# Altium schematic sheet ArcadeTestHAT 05 MCU.SchDoc: MCU and associated circuitry
size A3; SheetNumber: 2; SheetTotal: 2; VersionControl_RevNumber: 1
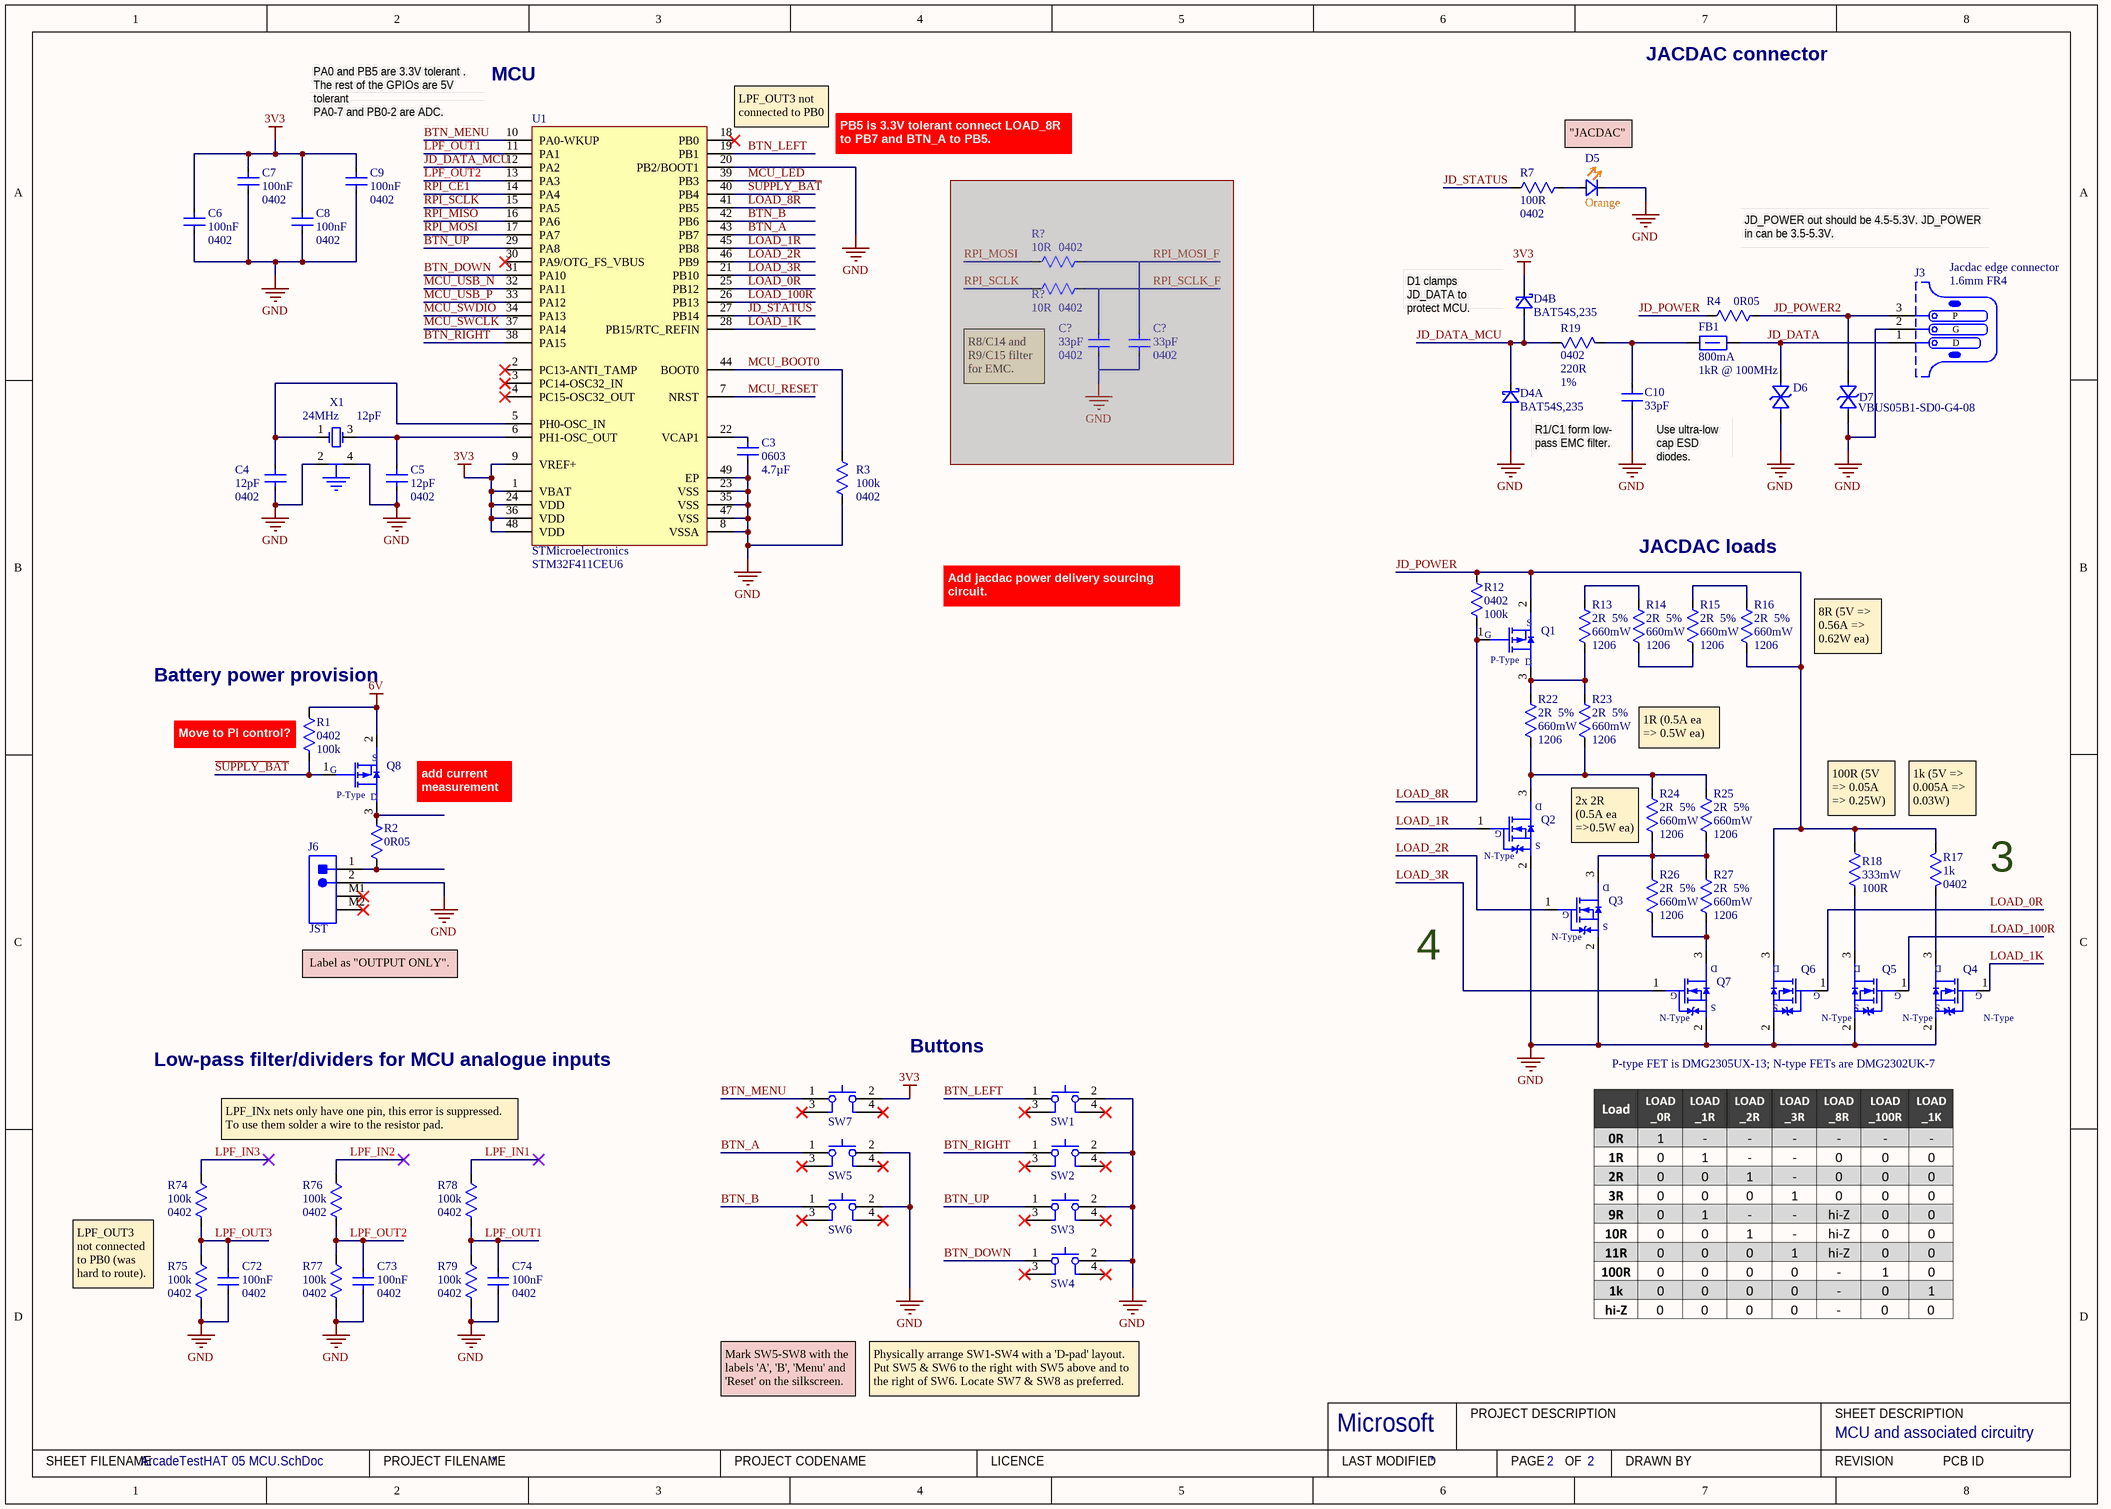
[diagram p0: ArcadeTestHAT 05 MCU.SchDoc]

## Parts
(Parts that share a designator on the sheet are numbered #1, #2 ... from top to bottom, then left to right.)
C3  Case/Package: 0603  Capacitance: 4.7µF  [CAP 0603 (1608) x 1.2mm]  (hidden comment: CL10A475KP8NNNC)
C4  value 12pF  Package Size: 0402  [CAP0402]  (hidden comment: CAP0402_GENERIC 12pF)
C5  value 12pF  Package Size: 0402  [CAP0402]  (hidden comment: CAP0402_GENERIC 12pF)
C6  Case/Package: 0402  Capacitance: 100nF  [CAP0402]  (hidden comment: 0402YG104ZAT2A)
C7  Case/Package: 0402  Capacitance: 100nF  [CAP0402]  (hidden comment: 0402YG104ZAT2A)
C8  Case/Package: 0402  Capacitance: 100nF  [CAP0402]  (hidden comment: 0402YG104ZAT2A)
C9  Case/Package: 0402  Capacitance: 100nF  [CAP0402]  (hidden comment: 0402YG104ZAT2A)
C10  Capacitance: 33pF  [CAPC1005-EIA0402 0.55MM HIGH]  (hidden comment: C1005C0G1H330J050BA)
C72  Case/Package: 0402  Capacitance: 100nF  [CAP0402]  (hidden comment: 0402YG104ZAT2A)
C73  Case/Package: 0402  Capacitance: 100nF  [CAP0402]  (hidden comment: 0402YG104ZAT2A)
C74  Case/Package: 0402  Capacitance: 100nF  [CAP0402]  (hidden comment: 0402YG104ZAT2A)
C?#1  value 33pF  Package Size: 0402  [CAP0402]  (hidden comment: CAP0402_GENERIC 33pF)  (masked out: inside a compile mask, not in the netlist)
C?#2  value 33pF  Package Size: 0402  [CAP0402]  (hidden comment: CAP0402_GENERIC 33pF)  (masked out: inside a compile mask, not in the netlist)
D4  Manufacturer Part Number: BAT54S,235  [NXP-BAT54S-TO-236AB - without outline]  (hidden comment: BAT54S)  (parts A,B of 2)
D5  Colour: Orange  [Rohm SML-D12 Orange]  (hidden comment: SML-D12D)
D6  VBUS05B1-SD0-G4-08  [0201-VBUS05B1-SD0-G4-08 - Without outline]  (value not drawn)
D7  VBUS05B1-SD0-G4-08  [0201-VBUS05B1-SD0-G4-08 - Without outline]
FB1  Current Rating: 800mA  Impedance: 1kR @ 100MHz  [TDK MPZ1608 0.8mm - without outline]  (hidden comment: TDK MPZ1608S102ATA00)
J3  Jacdac edge connector  PCB Type: 1.6mm FR4  [JACDAC_EDGE_CONNECTOR_0.2mm_T&G]  (no BOM)
J6  Manufacturer: JST  [JST- S2B-PH-SM4-TB(LF)(SN)-2_V]  (hidden comment: S2B-PH-SM4-TB(LF)(SN) (originally from Octopart))
Q1  MOSFET P-CH 20V 4.2A SOT23  [DIODES-SOT23-3]  (value not drawn)
Q2  MOSFET N-CH 20V 2.8A SOT23  [DIODES-SOT23-3]  (value not drawn)
Q3  MOSFET N-CH 20V 2.8A SOT23  [DIODES-SOT23-3]  (value not drawn)
Q4  MOSFET N-CH 20V 2.8A SOT23  [DIODES-SOT23-3]  (value not drawn)
Q5  MOSFET N-CH 20V 2.8A SOT23  [DIODES-SOT23-3]  (value not drawn)
Q6  MOSFET N-CH 20V 2.8A SOT23  [DIODES-SOT23-3]  (value not drawn)
Q7  MOSFET N-CH 20V 2.8A SOT23  [DIODES-SOT23-3]  (value not drawn)
Q8  MOSFET P-CH 20V 4.2A SOT23  [DIODES-SOT23-3]  (value not drawn)
R1  Case Code (Imperial): 0402  Resistance: 100k  [RES0402]  (hidden comment: MCWR04X1003FTL)
R2  value 0R05  [RES1206]  (hidden comment: KDV12FR050ET)
R3  Case Code (Imperial): 0402  Resistance: 100k  [RES0402]  (hidden comment: MCWR04X1003FTL)
R4  value 0R05  [RES1206]  (hidden comment: KDV12FR050ET)
R7  value 100R  Case: 0402  [RES0402]  (hidden comment: RES0402_GENERIC 100R)
R12  Case Code (Imperial): 0402  Resistance: 100k  [RES0402]  (hidden comment: MCWR04X1003FTL)
R13  Tolerance: 5%  Case/Package: 1206  Power Rating: 660mW  Resistance: 2R  [RES1206]  (hidden comment: ERJ-P08J2R0V)
R14  Tolerance: 5%  Case/Package: 1206  Power Rating: 660mW  Resistance: 2R  [RES1206]  (hidden comment: ERJ-P08J2R0V)
R15  Tolerance: 5%  Case/Package: 1206  Power Rating: 660mW  Resistance: 2R  [RES1206]  (hidden comment: ERJ-P08J2R0V)
R16  Tolerance: 5%  Case/Package: 1206  Power Rating: 660mW  Resistance: 2R  [RES1206]  (hidden comment: ERJ-P08J2R0V)
R17  Case: 0402  [RES0402]  (hidden comment: 1k)
R18  Max Power Dissipation: 333mW  Resistance: 100R  [RES0805]
R19  Case Code (Imperial): 0402  Resistance: 220R  Tolerance: 1%  [RES0402]  (hidden comment: RC0402FR-07220RL)
R22  Tolerance: 5%  Case/Package: 1206  Power Rating: 660mW  Resistance: 2R  [RES1206]  (hidden comment: ERJ-P08J2R0V)
R23  Tolerance: 5%  Case/Package: 1206  Power Rating: 660mW  Resistance: 2R  [RES1206]  (hidden comment: ERJ-P08J2R0V)
R24  Tolerance: 5%  Case/Package: 1206  Power Rating: 660mW  Resistance: 2R  [RES1206]  (hidden comment: ERJ-P08J2R0V)
R25  Tolerance: 5%  Case/Package: 1206  Power Rating: 660mW  Resistance: 2R  [RES1206]  (hidden comment: ERJ-P08J2R0V)
R26  Tolerance: 5%  Case/Package: 1206  Power Rating: 660mW  Resistance: 2R  [RES1206]  (hidden comment: ERJ-P08J2R0V)
R27  Tolerance: 5%  Case/Package: 1206  Power Rating: 660mW  Resistance: 2R  [RES1206]  (hidden comment: ERJ-P08J2R0V)
R74  Case Code (Imperial): 0402  Resistance: 100k  [RES0402]  (hidden comment: MCWR04X1003FTL)
R75  Case Code (Imperial): 0402  Resistance: 100k  [RES0402]  (hidden comment: MCWR04X1003FTL)
R76  Case Code (Imperial): 0402  Resistance: 100k  [RES0402]  (hidden comment: MCWR04X1003FTL)
R77  Case Code (Imperial): 0402  Resistance: 100k  [RES0402]  (hidden comment: MCWR04X1003FTL)
R78  Case Code (Imperial): 0402  Resistance: 100k  [RES0402]  (hidden comment: MCWR04X1003FTL)
R79  Case Code (Imperial): 0402  Resistance: 100k  [RES0402]  (hidden comment: MCWR04X1003FTL)
R?#1  value 10R  Case: 0402  [RES0402]  (hidden comment: RES0402_GENERIC 10R)  (masked out: inside a compile mask, not in the netlist)
R?#2  value 10R  Case: 0402  [RES0402]  (hidden comment: RES0402_GENERIC 10R)  (masked out: inside a compile mask, not in the netlist)
SW1  Tact Wurth 430152050826  [Wurth 430152050836-WIDE]  (value not drawn)
SW2  Tact Wurth 430152050826  [Wurth 430152050836-WIDE]  (value not drawn)
SW3  Tact Wurth 430152050826  [Wurth 430152050836-WIDE]  (value not drawn)
SW4  Tact Wurth 430152050826  [Wurth 430152050836-WIDE]  (value not drawn)
SW5  Tact Wurth 430152050826  [Wurth 430152050836-WIDE]  (value not drawn)
SW6  Tact Wurth 430152050826  [Wurth 430152050836-WIDE]  (value not drawn)
SW7  Tact Wurth 430152050826  [Wurth 430152050836-WIDE]  (value not drawn)
U1  Manufacturer: STMicroelectronics  Manufacturer Part Number: STM32F411CEU6  [ST UFQFPN48 SEH]  (hidden comment: ST STM32F411CEU6)
X1  Frequency: 24MHz  Loading capacitance: 12pF  [generic xtal 3.2x2.5]  (hidden comment: 24MHz SMD xtal 3.2x2.5mm)

## Nets
3V3: C6.2 C7.2 C8.2 C9.2 D4.2(K) SW7.2 U1.1(VBAT) U1.9(VREF+) U1.24(VDD) U1.36(VDD) U1.48(VDD)
6V: Q8.2(S) R1.1
GND: C3.1 C4.1 C5.1 C6.1 C7.1 C8.1 C9.1 C10.1 C72.1 C73.1 C74.1 D4.1(A) D5.1(K) D6.2(A) D7.2(A) J3.2(G) J6.2 Q2.2(S) Q3.2(S) Q4.2(S) Q5.2(S) Q6.2(S) Q7.2(S) R3.2 R75.2 R77.2 R79.2 SW1.2 SW2.2 SW3.2 SW4.2 SW5.2 SW6.2 U1.8(VSSA) U1.20(PB2/BOOT1) U1.23(VSS) U1.35(VSS) U1.47(VSS) U1.49(EP) X1.2 X1.4
~{SUPPLY_BAT}: Q8.1(G) R1.2 U1.40(PB4)
BTN_A: SW5.1 U1.43(PB7)
BTN_B: SW6.1 U1.42(PB6)
BTN_DOWN: SW4.1 U1.31(PA10)
BTN_LEFT: SW1.1 U1.19(PB1)
BTN_MENU: SW7.1 U1.10(PA0-WKUP)
BTN_RIGHT: SW2.1 U1.38(PA15)
BTN_UP: SW3.1 U1.29(PA8)
JD_DATA: D6.1(K) FB1.1 J3.1(D)
JD_DATA_MCU: D4.3(K) R19.1 U1.12(PA2)
JD_POWER: Q1.2(S) Q6.3(D) R4.1 R12.1 R16.2 R17.1 R18.1
JD_POWER2: D7.1(K) J3.3(P) R4.2
JD_STATUS: R7.1 U1.27(PB14)
LOAD_0R: Q6.1(G) U1.25(PB12)
LOAD_1K: Q4.1(G) U1.28(PB15/RTC_REFIN)
LOAD_1R: Q2.1(G) U1.45(PB8)
LOAD_2R: Q3.1(G) U1.46(PB9)
LOAD_3R: Q7.1(G) U1.21(PB10)
LOAD_8R: Q1.1(G) R12.2 U1.41(PB5)
LOAD_100R: Q5.1(G) U1.26(PB13)
LPF_IN1: R78.1
LPF_IN2: R76.1
LPF_IN3: R74.1
LPF_OUT1: C74.2 R78.2 R79.1 U1.11(PA1)
LPF_OUT2: C73.2 R76.2 R77.1 U1.13(PA3)
LPF_OUT3: C72.2 R74.2 R75.1
MCU_BOOT0: R3.1 U1.44(BOOT0)
MCU_LED: U1.39(PB3)
MCU_RESET: U1.7(NRST)
MCU_SWCLK: U1.37(PA14)
MCU_SWDIO: U1.34(PA13)
MCU_USB_N: U1.32(PA11)
MCU_USB_P: U1.33(PA12)
RPI_CE1: U1.14(PA4)
RPI_MISO: U1.16(PA6)
RPI_MOSI: U1.17(PA7)
RPI_SCLK: U1.15(PA5)
NetC3_2: C3.2 U1.22(VCAP1)
NetC4_2: C4.2 U1.5(PH0-OSC_IN) X1.1
NetC5_2: C5.2 U1.6(PH1-OSC_OUT) X1.3
NetC10_2: C10.2 FB1.2 R19.2
NetD5_2: D5.2(A) R7.2
NetJ6_1: J6.1 R2.1
NetQ1_3: Q1.3(D) R13.2 R22.1 R23.1
NetQ2_3: Q2.3(D) R22.2 R23.2 R24.1 R25.1
NetQ3_3: Q3.3(D) R24.2 R25.2 R26.1 R27.1
NetQ4_3: Q4.3(D) R17.2
NetQ5_3: Q5.3(D) R18.2
NetQ7_3: Q7.3(D) R26.2 R27.2
NetQ8_3: Q8.3(D) R2.2
NetR13_1: R13.1 R14.1
NetR14_2: R14.2 R15.2
NetR15_1: R15.1 R16.1

Not connected (* = marked no-connect by the designer): J6 M1* M2*; SW1 3* 4*; SW2 3* 4*; SW3 3* 4*; SW4 3* 4*; SW5 3* 4*; SW6 3* 4*; SW7 3* 4*; U1 2(PC13-ANTI_TAMP)* 3(PC14-OSC32_IN)* 4(PC15-OSC32_OUT)* 18(PB0)* 30(PA9/OTG_FS_VBUS)*

## Notes on the sheet
- PA0 and PB5 are 3.3V tolerant . The rest of the GPIOs are 5V tolerant
- MCU
- JACDAC connector
- PA0-7 and PB0-2 are ADC.
- (near U1) LPF_OUT3 not connected to PB0
- PB5 is 3.3V tolerant connect LOAD_8R to PB7 and BTN_A to PB5.
- "JACDAC"
- JD_POWER out should be 4.5-5.3V. JD_POWER in can be 3.5-5.3V.
- (near D4) D1 clamps JD_DATA to protect MCU.
- R8/C14 and R9/C15 filter for EMC.
- R1/C1 form low-
  pass EMC filter.
- (near C10) Use ultra-low cap ESD diodes.
- JACDAC loads
- Add jacdac power delivery sourcing circuit.
- 8R (5V => 0.56A => 0.62W ea)
- (near R1) Battery power provision
- (near R1) Move to Pi control?
- 1R (0.5A ea => 0.5W ea)
- add current measurement
- (near R24) 2x 2R (0.5A ea =>0.5W ea)
- 100R (5V => 0.05A => 0.25W)
- (near R17) 1k (5V => 0.005A => 0.03W)
- (near R17) 3
- (near J6) Label as "OUTPUT ONLY".
- 4
- Buttons
- Low-pass filter/dividers for MCU analogue inputs
- P-type FET is DMG2305UX-13; N-type FETs are DMG2302UK-7
- LPF_INx nets only have one pin, this error is suppressed. To use them solder a wire to the resistor pad.
- LPF_OUT3 not connected to PB0 (was hard to route).
- Mark SW5-SW8 with the labels 'A', 'B', 'Menu' and 'Reset' on the silkscreen.
- Physically arrange SW1-SW4 with a 'D-pad' layout. Put SW5 & SW6 to the right with SW5 above and to the right of SW6. Locate SW7 & SW8 as preferred.
- Microsoft
- PROJECT DESCRIPTION
- SHEET DESCRIPTION
- SHEET FILENAME
- PROJECT FILENAME
- PROJECT CODENAME
- LICENCE
- LAST MODIFIED
- PAGE
- OF
- DRAWN BY
- REVISION
- PCB ID
- (in symbol DMG2302UK-whitesch) N-Type
- (in symbol DMG2305UX-whitesch) P-Type

## Library data of the parts
C3 = 4.7uF 10V X5R ±10% Samsung CL: Generic 0603 capacitor 4.7uF 10V, e.g. Samsung CL10A475KP8NNNC; Dielectric: X5R; Tolerance: 10%; Created By: shodges; Supplier 1: Digi-Key; Manufacturer: Samsung; Manufacturer Part Number: CL10A475KP8NNNC; Stock 1: 40000; Pricing 1: 1=0.15, 10=0.109, 100=0.0513, 500=0.036, 1000=0.0298 (USD); Mount: Surface Mount; Case Code (Imperial): 0603; Contact Plating: Tin; Min Operating Temperature: -55°C; Max Operating Temperature: 85°C; Package Quantity: 1; Packaging: Tape and Reel; Length: 1.6mm; Height: 0.8mm; Width: 0.031inch; Thickness: 0.035inch; Depth: 0.8mm; Radiation Hardening: No; Supplier Part Number 1: 1276-1044-1-ND; Supplier 2: Farnell; Supplier Part Number 2: 3010071; Case Code (Metric): 1608; Voltage Rating: 10V
C4 C5 = CAP0402_GENERIC: Generic 0402 capacitor 12pF; Rated Voltage: * V; Manufacturer: Generic
C6-C9 C72-C74 = 0402YG104ZAT2A: Generic 0402 capacitor 100nF 16V, e.g. AVX 0402YG104ZAT2A; Manufacturer: Kyocera AVX; Tolerance: 80%; Dielectric: Y5V; Insulation Resistance: 100GR; Dissipation Factor: 9%; Supplier 1: Digi-Key; Manufacturer Part Number: 0402YG104ZAT2A; Stock 1: 0; Pricing 1: 1=0.1, 10=0.041, 100=0.0183, 500=0.01306, 1000=0.01026, 2500=0.00933, 5000=0.00858 (USD); Mount: Surface Mount,PCB; Case Code (Metric): 1005; Case Code (Imperial): 0402; Contact Plating: Tin,Matte; Min Operating Temperature: -30°C; Max Operating Temperature: 85°C; Packaging: Tape and Reel; Voltage Rating (DC): 16V; Termination: SMD/SMT; Voltage: 16V; Package Quantity: 1; Voltage Rating: 16V; Length: 1mm; Height: 0.5mm; Depth: 0.5mm; Width: 0.02inch; Thickness: 0.022inch; Radiation Hardening: No; REACH SVHC: No SVHC; Lead Free: Lead Free; ComponentLink2URL: http://datasheets.avx.com/Y5V.pdf; ComponentLink2Description: AVX datasheet online; Supplier 2: Farnell; Supplier 3: Mouser; Supplier 4: RSComponents; Supplier Part Number 1: 478-1138-1-ND; Supplier Part Number 2: 1327667; Supplier Part Number 3: 581-040216G104Z; Supplier Part Number 4: 698-3190
C10 = 33pF 0402 C0G, NP0 50V: CAP CER 33PF 50V C0G 0402; Manufacturer: TDK Corporation; Tolerance: ±5%; Dielectric Material: Ceramic; Supplier 1: Mouser; Manufacturer Part Number: C1005C0G1H330J050BA; RoHS: RoHS Compliant; Category: Capacitors; Stock 1: 78754; Pricing 1: 1=0.25000, 10=0.03100, 100=0.02200, 500=0.01900, 1000=0.01500, 2500=0.01200, 10000=0.00900, 20000=0.00800, 50000=0.00700 (USD); Packaging: Tape & Reel (TR); Voltage - Rated: 50V; Temperature Coefficient: C0G, NP0; Mounting Type: Surface Mount, MLCC; Operating Temperature: -55°C ~ 125°C; Applications: General Purpose; Package / Case: 0402 (1005 Metric); Size / Dimension: 0.039" L x 0.020" W (1.00mm x 0.50mm); Height - Seated (Max): -; Thickness (Max): 0.022" (0.55mm); Lead Spacing: -; Features: -; Lead Style: -; ComponentLink1URL: http://product.tdk.com/en/catalog/datasheets/mlcc_commercial_general_en.pdf; ComponentLink1Description: Online datasheet; Supplier Part Number 1: 810-C1005C0G1H330J; Ratings: -; Mount: Surface Mount; Case/Package: 0402; Case Code (Imperial): 0402; Case Code (Metric): 1005; Weight: 2.3E-05oz; Min Operating Temperature: -55°C; Max Operating Temperature: 125°C; Dielectric: C0G; Termination: SMD/SMT; Voltage: 50V; Voltage Rating: 50V; Voltage Rating (DC): 50V; Package Quantity: 1; Length: 1mm; Width: 0.5mm; Height: 0.5mm; Depth: 0.5mm; Thickness: 0.022inch; Radiation Hardening: No; Lead Free: Lead Free; REACH SVHC: No SVHC; Supplier 2: Farnell; Stock 2: 30000; Pricing 2: 10000=0.00620 (GBP); Supplier 3: Future Electronics; Stock 3: 10000; Pricing 3: 10000=0.00850, 30000=0.00700, 40000=0.00700, 100000=0.00690, 150000=0.00680 (USD); Supplier Part Number 2: 2521806; Supplier Part Number 3: 4011038
C?#1 C?#2 = CAP0402_GENERIC: Generic 0402 Chip Capacitor 33pF; Rated Voltage: * V
D4 = BAT54S: DIODE ARRAY SCHOTTKY 30V SOT23; Manufacturer: Nexperia; Supplier 1: Digi-Key; RoHS: No; Category: Rectifier Diodes; Stock 1: 14011; Pricing 1: 1=0.13000, 10=0.11900, 100=0.05610, 500=0.03326, 1000=0.02185, 5000=0.02138 (USD); ComponentLink1URL: https://assets.nexperia.com/documents/data-sheet/BAT54_SER.pdf; ComponentLink1Description: NXP datasheet online; Supplier 2: Mouser; Supplier 3: RSComponents; Supplier Part Number 2: 771-BAT54S235; Supplier Part Number 3: 1707990; Supplier Part Number 1: 1727-1868-1-ND
D5 = SML-D12D: 1.6 x 0.8 x 0.55mm (0603) LED 605nm Orange; Manufacturer: Rohm Semiconductor; Manufacturer Part Number: SML-D12D8WT86; Millicandela Rating: 100mcd; Voltage - Forward (Vf) (Typ): 2.2V; Current - Test: 20mA; Lens Type: Diffused, White; Lens Style/Size: Rectangle with Flat Top, 1.2mm x 0.8mm; Supplier 1: Digi-Key; RoHS: RoHS Compliant; Category: Optoelectronics; Stock 1: 1719; Pricing 1: 1=0.38, 10=0.279, 25=0.2232, 100=0.1478, 250=0.1046, 500=0.08926, 1000=0.06974 (GBP); Packaging: Cut Tape (CT); Wavelength - Dominant: 605nm; Wavelength - Peak: -; Viewing Angle: -; Package / Case: 0603 (1608 Metric); Size / Dimension: 1.60mm L x 0.80mm W; Height: 0.55mm; Mounting Type: Surface Mount; Luminous Flux @ Current - Test: -; ComponentLink1URL: http://rohmfs.rohm.com/en/products/databook/datasheet/opto/led/chip_mono/sml-d1.pdf; ComponentLink1Description: http://rohmfs.rohm.com/en/products/databook/datasheet/opto/led/chip_mono/sml-d1.pdf; Supplier Part Number 1: 511-1577-1-ND
D6 D7 = VBUS05B1-SD0-G4-08: TVS DIODE 5.5V 18V CLP0603; Manufacturer: Vishay Semiconductors; Peak Pulse Current: 2.5A; Number of Bidirectional Channels: 1; Min Breakdown Voltage: 6V; Peak Pulse Power: 45W; Power Line Protection: No; Direction: Bidirectional; Capacitance: 0.4pF; Element Configuration: Single; Supplier 1: Digi-Key; RoHS: Yes; Category: TVS Diodes; Stock 1: 22028; Pricing 1: 1=0.27000, 10=0.18500, 100=0.09020, 500=0.07524, 1000=0.05228, 2000=0.04531, 5000=0.04203 (USD); Mount: Surface Mount; Case/Package: 0201; Number of Pins: 2; Case Code (Metric): 0603; Case Code (Imperial): 0201; Min Operating Temperature: -55°C; Max Operating Temperature: 150°C; Packaging: Tape and Reel; Reverse Standoff Voltage: 5.5V; Clamping Voltage: 18V; Working Voltage: 5.5V; Resistor Type: Zener; ComponentLink2URL: http://www.vishay.com/docs/85899/vbus05b1-sd0.pdf; ComponentLink2Description: Online datasheet; Supplier 2: Farnell; Stock 2: 13100; Pricing 2: 5=0.20800, 10=0.14000, 100=0.06340, 500=0.05020, 1000=0.04160, 5000=0.03300 (GBP); Supplier 3: Mouser; Stock 3: 1209; Pricing 3: 1=0.27000, 10=0.18500, 50=0.18500, 100=0.09300, 1000=0.03900, 10000=0.03400 (USD); Supplier 4: Arrow Electronics; Stock 4: 719; Pricing 4: 1=0.17630, 10=0.14370, 25=0.14230, 100=0.07810, 250=0.07660, 500=0.06310, 15000=0.02980, 150000=0.02970, 1500000=0.02870, 7500000=0.02800 (USD); Supplier Part Number 4: VBUS05B1-SD0-G4-08; Supplier Part Number 3: 78-VBUS05B1SD0-G4-08; Supplier Part Number 1: VBUS05B1-SD0-G4-08GICT-ND; Supplier Part Number 2: 2932858; Created By: D. Gakure; Checked By: ?; Manufacturer Part Number: VBUS05B1-SD0-G4-08
FB1 = TDK MPZ1608S102ATA00: 0603 1k@100MHz 0.8A chip; Core Material: Ferrite; Tolerance: 25%; DC Resistance (DCR): 300mR; Supplier 1: Digi-Key; Stock 1: 113542; Pricing 1: 1=0.1, 10=0.079, 25=0.0716, 50=0.0644, 100=0.0472, 250=0.03432, 500=0.03146, 1000=0.02717 (USD); Mount: Surface Mount; Case/Package: 0603; Case Code (Metric): 1608; Case Code (Imperial): 0603; Package Quantity: 4000; Packaging: Tape and Reel; Max DC Current: 800mA; Length: 0.063inch; Height: 0.037inch; Width: 0.031inch; ComponentLink2URL: https://www.mouser.co.uk/datasheet/2/400/eads_commercial_power_mpz1608_en-923650.pdf; ComponentLink2Description: datasheet online; Supplier 2: Mouser; ComponentLink3Description: datasheet; ComponentLink3URL: Y:\System\Altium\Libraries 2014\TDK\Datasheets\eads_commercial_power_mpz1608_en-923650.pdf; Supplier Part Number 1: 445-8694-1-ND; Supplier Part Number 2: 810-MPZ1608S102ATA00; Manufacturer: TDK; Manufacturer Part Number: MPZ1608S102ATA00
J3 = Jacdac edge connector: 3 pin Jacdac edge connector 1.27mm pitch; Manufacturer Part Number: JACDAC_EDGE_CONNECTOR; Checked By: ?; Created By: D. Gakure; ComponentLink1Description: Yuliang JACDAC cable connector drawing online; ComponentLink1URL: https://github.com/microsoft/jacdac-mdk/blob/main/connector/JACDAC-Connector-by-Yuliang-2020-11-28.pdf; ComponentLink2Description: JACDAC PCB edge connector spec onlin; ComponentLink2URL: https://github.com/microsoft/jacdac-mdk/blob/main/connector/JACDAC_PCB_Edge_Connector_Drawing_JD-PEC-01_rev_01.pdf
J6 = S2B-PH-SM4-TB(LF)(SN): Male header, pitch 2 mm, 1x2 position; Current Rating: 2A; Voltage Rating: 100V; Number of Poles: 2; Insulation Resistance: 1GR; Contact Resistance: 20mR; Connector Type: Male Pin; Pitch: 2mm; Min Operating Temperature: -25°C; Width: 5mm; ComponentLink1Description: JST connector selector website; ComponentLink2Description: JST datasheet; ComponentLink1URL: http://www.jst.com/home2.html; Contact Plating: Tin,Copper; ComponentLink2URL: http://www.jst-mfg.com/product/pdf/eng/ePH.pdf; Mount: Surface Mount; Length: 7.9mm; Lead Pitch: 2mm; Max Operating Temperature: 85°C; Height: 9.4mm; Packaging: Tape and Reel; Contact Material: Copper Alloy,Bronze,Tin,Brass; Supplier 1: Digi-Key; Stock 1: 179134; Pricing 1: 1=0.58, 10=0.547, 100=0.4194, 500=0.3647 (USD); Color: Natural,White; Housing Color: Beige; Housing Material: Polyamide; Number of Rows: 1; Number of Positions: 2; Termination: Solder; Orientation: Right Angle; Gender: Male; Voltage Rating (AC): 100V; Max Current Rating: 2A; Fastening Type: Detent; Number of Contacts: 2; Working Voltage: 100V; Max Voltage Rating (AC): 100V; Max Voltage Rating (DC): 100V; Contact Mating Length: 0.13inch; Depth: 7.6mm; REACH SVHC: No SVHC; Lead Free: Lead Free; Flammability Rating: UL94 V-0; Supplier 2: Farnell; Supplier 3: RSComponents; Supplier Part Number 1: 455-1749-1-ND; Supplier Part Number 2: 9492615; Supplier Part Number 3: 688-1353; Manufacturer Part Number: S2B-PH-SM4-TB(LF)(SN)
Q1 Q8 = DMG2305UX-whitesch: Manufacturer: Diodes; Manufacturer Part Number: DMG2305UX-13; Rise Time: 13.7ns; Rds On Max: 52mR; Input Capacitance: 808pF; Max Power Dissipation: 1.4W; Turn-On Delay Time: 10.8ns; Turn-Off Delay Time: 79.3ns; Fall Time: 34.7ns; Threshold Voltage: -900mV; Element Configuration: Single; Gate to Source Voltage (Vgs): 8V; Number of Channels: 1; Drain to Source Breakdown Voltage: -20V; On-State Resistance: 65MR; Supplier 1: Digi-Key; Stock 1: 131638; Pricing 1: 1=0.44, 10=0.398, 100=0.2228, 500=0.1194, 1000=0.0812 (USD); Mount: Surface Mount; Case/Package: TO-236-3; Number of Pins: 3; Weight: 0.000282oz; Min Operating Temperature: -55°C; Max Operating Temperature: 150°C; Package Quantity: 1; Packaging: Tape and Reel; Continuous Drain Current (ID): 4.2A; Drain to Source Voltage (Vdss): 20V; Drain to Source Resistance: 52mR; Length: 3mm; Height: 1.1mm; Width: 1.4mm; Radiation Hardening: No; REACH SVHC: No SVHC; Lead Free: Lead Free; ComponentLink2URL: https://datasheet.ciiva.com/18566/dmg2305ux-18566951.pdf; ComponentLink2Description: online datasheet; Supplier Part Number 1: DMG2305UX-13DICT-ND; ComponentLink3Description: datasheet; ComponentLink3URL: Y:\System\Altium\Libraries 2014\Diodes Inc\Datasheets\dmg2305ux-30023840.pdf; Supplier 2: Farnell; Supplier 3: Mouser; Supplier 4: RSComponents; Supplier Part Number 2: 2543533; Supplier Part Number 3: 621-DMG2305UX-7; Supplier Part Number 4: 8270452
Q2-Q7 = DMG2302UK-whitesch: Manufacturer: Diodes; Manufacturer Part Number: DMG2302UK-7; Rds On Max: 90mR; Input Capacitance: 130pF; Max Power Dissipation: 660mW; ComponentLink2URL: https://www.diodes.com/assets/Datasheets/DMG2302UK.pdf; ComponentLink2Description: online datasheet; ComponentLink3Description: datasheet; ComponentLink3URL: Y:\System\Altium\Libraries 2014\Diodes Inc\Datasheets\DMG2302UK.pdf; Supplier 1: Digi-Key; Stock 1: 37938; Pricing 1: 1=0.34000, 10=0.25000, 100=0.11890, 500=0.09704, 1000=0.07199 (USD); RoHS: Yes; Mount: Surface Mount; Case/Package: TO-236-3; Min Operating Temperature: -55°C; Max Operating Temperature: 150°C; Packaging: Tape and Reel; Drain to Source Voltage (Vdss): 20V; Continuous Drain Current (ID): 2.8A; Supplier 2: Farnell; Supplier 3: Mouser; Supplier 4: RSComponents; Supplier Part Number 1: DMG2302UK-7DICT-ND; Supplier Part Number 2: 3127315; Supplier Part Number 3: 621-DMG2302UK-7; Supplier Part Number 4: 1333362
R1 = MCWR04X1003FTL: Generic 0402 resistor 100k, e.g. Multicomp MCWR04X1003FTL; Power Rating: 62.5mW; Tolerance: 1%; Voltage Rating: 50V; Temperature Coefficient: 100ppm/°C; Supplier 1: Farnell; Manufacturer: Multicomp; Manufacturer Part Number: MCWR04X1003FTL; Stock 1: 414470; Pricing 1: 10=0.0041, 100=0.0025, 500=0.0018, 2500=0.0014, 5000=0.0011 (GBP); Mount: Surface Mount; Case/Package: 0402; Case Code (Metric): 1005; Packaging: Cut Tape; Composition: Thick Film; Voltage Rating (DC): 50V; REACH SVHC: No SVHC; ComponentLink1URL: http://www.farnell.com/datasheets/1849611.pdf?src-supplier=Element14; ComponentLink1Description: Multicomp datasheet online; Supplier Part Number 1: 2447094; ComponentLink2Description: datasheet; ComponentLink2URL: Y:\System\Altium\Libraries 2014\Multicomp\datasheets\thick film chip resistors 1849611.pdf
R2 R4 = KDV12FR050ET: Generic 1206 resistor 0.05R 1% 0.5W, e.g. Ohmite KDV12FR050ET; Power: 500mW; Supplier 1: Digi-Key; Manufacturer: Ohmite; Manufacturer Part Number: KDV12FR050ET; Stock 1: 4924; Pricing 1: 1=0.29000, 10=0.24200, 25=0.17600, 50=0.12760, 100=0.09460, 250=0.07260, 500=0.05720, 1000=0.03960 (USD); Supplier 2: Farnell; Supplier 3: Mouser; Supplier Part Number 1: 273-KDV12FR050ETCT-ND; Supplier Part Number 2: 3273730; Supplier Part Number 3: 588-KDV12FR050ET; ComponentLink1Description: Ohmite datasheet online; ComponentLink1URL: https://www.ohmite.com/assets/docs/res_kdv.pdf; Tolerance: 1%; Package Size: 1206
R3 R12 R74-R79 = MCWR04X1003FTL: generic 0402 resistor 100k, e.g. Multicomp MCWR04X1003FTL; Power Rating: 62.5mW; Tolerance: 1%; Voltage Rating: 50V; Temperature Coefficient: 100ppm/°C; Supplier 1: Farnell; Manufacturer: Multicomp; Manufacturer Part Number: MCWR04X1003FTL; Stock 1: 414470; Pricing 1: 10=0.0041, 100=0.0025, 500=0.0018, 2500=0.0014, 5000=0.0011 (GBP); Mount: Surface Mount; Case/Package: 0402; Case Code (Metric): 1005; Packaging: Cut Tape; Composition: Thick Film; Voltage Rating (DC): 50V; REACH SVHC: No SVHC; ComponentLink1URL: http://www.farnell.com/datasheets/1849611.pdf?src-supplier=Element14; ComponentLink1Description: Multicomp datasheet online; Supplier Part Number 1: 2447094; ComponentLink2Description: datasheet; ComponentLink2URL: Y:\System\Altium\Libraries 2014\Multicomp\datasheets\thick film chip resistors 1849611.pdf
R7 = RES0402_GENERIC: Generic 0402 resistor 100R; Manufacturer: Generic
R13-R16 R22-R27 = ERJ-P08J2R0V: Generic 1206 resistor 2R 0.33W 5%, e.g. Panasonic ERJ-P08J2R0V; Voltage Rating: 500V; Temperature Coefficient: 600ppm/°C; Voltage Rating (DC): 200V; Supplier 1: Digi-Key; Manufacturer: Panasonic; Manufacturer Part Number: ERJ-P08J2R0V; Stock 1: 0; Pricing 1: 5000=0.01560 (USD); RoHS: Yes; Mount: Surface Mount; Number of Pins: 2; Case Code (Imperial): 1206; Case Code (Metric): 3216; Min Operating Temperature: -55°C; Max Operating Temperature: 155°C; Packaging: Tape and Reel; Package Quantity: 5000; Composition: Thick Film; Termination: SMD/SMT; Length: 3.2mm; Height: 0.6mm; Width: 1.6mm; Depth: 1.6mm; REACH SVHC: No SVHC; Supplier 2: Farnell; Supplier 3: Mouser; Supplier 4: RSComponents; Supplier Part Number 1: ERJ-P08J2R0V-ND; Supplier Part Number 2: 1894401; Supplier Part Number 3: 667-ERJ-P08J2R0V; Supplier Part Number 4: 721-8627; ComponentLink1Description: Panasonic datasheet online; ComponentLink1URL: https://industrial.panasonic.com/cdbs/www-data/pdf/RDO0000/AOA0000C331.pdf
R17 = RES0402_GENERIC: Generic 0402 resistor 1k; Value: 1k; Manufacturer: Generic
R18 = AS08J1000ET: Generic 0805 resistor 100R 5% 1/3W, e.g. Ohmite AS08J1000ET; Temperature Coefficient: 100ppm/°C; Supplier 1: Digi-Key; Manufacturer: Ohmite; Manufacturer Part Number: AS08J1000ET; Stock 1: 0; Pricing 1: 5000=0.02250 (USD); RoHS: Yes; Min Operating Temperature: -55°C; Max Operating Temperature: 155°C; Package Quantity: 5000; Packaging: Tape and Reel; Composition: Thick Film; Number of Terminations: 2; Length: 0.079inch; Height: 0.026inch; Width: 0.049inch; ComponentLink1URL: https://www.mouser.co.uk/datasheet/2/303/ohmite_res_as_smd-1189203.pdf; ComponentLink1Description: Ohmite datasheet online; Supplier 2: Mouser; Supplier Part Number 1: AS08J1000ET-ND; Supplier Part Number 2: 588-AS08J1000ET; Tolerance: 5%; Case/Package: 0805
R19 = RC0402FR-07220RL: RES SMD 220 OHM 1% 1/16W 0402; Manufacturer: Yageo; Power Rating: 62.5mW; Voltage Rating: 50V; Temperature Coefficient: 100ppm/°C; Max Power Dissipation: 63mW; Supplier 1: Digi-Key; Manufacturer Part Number: RC0402FR-07220RL; RoHS: Yes; Category: Resistors; Stock 1: 1286042; Pricing 1: 1=0.10000, 10=0.01400, 100=0.00580, 1000=0.00262, 2500=0.00228, 5000=0.00188 (USD); Case/Package: 0402; Number of Pins: 2; Case Code (Metric): 1005; Min Operating Temperature: -55°C; Max Operating Temperature: 155°C; Packaging: Tape and Reel; Voltage Rating (DC): 50V; Package Quantity: 1; Termination: SMD/SMT; Resistor Type: Thick Film; Number of Terminations: 2; Features: Moisture Resistant; Length: 1mm; Height: 0.016inch; Width: 0.02inch; Depth: 0.5mm; REACH SVHC: No SVHC; Military Standard: Not; Lead Free: Lead Free; ComponentLink1URL: https://datasheet.ciiva.com/11819/0900766b80c66297-11819466.pdf; ComponentLink1Description: Online datasheet; Supplier 2: Mouser; Stock 2: 324625; Pricing 2: 1=0.10000, 10=0.01200, 100=0.00400, 1000=0.00400, 2500=0.00400, 10000=0.00300 (USD); Supplier 3: Farnell; Stock 3: 18234; Pricing 3: 1=0.08130, 25=0.01210, 100=0.01120, 250=0.01030, 500=0.00900 (GBP); Supplier Part Number 3: 2147864; Supplier Part Number 2: 603-RC0402FR-07220RL; Supplier Part Number 1: 311-220LRCT-ND; Created: D.G; Checked: ?
R?#1 R?#2 = RES0402_GENERIC: Generic 0402 Chip Resistor 10R
SW1-SW7 = Tact Wurth 430152050826: Generic 6x6mm SPST button e,g, Wurth 430152050826; Manufacturer: Wurth Electronics; Switch Function: Off-Mom; Actuator Type: Standard; Operating Force: 260gf; Actuator Material: Polymer,Liquid Crystal Polymer; Switch Travel: 0.25mm; Mechanical Life: 200000Cycles; Contact Current Rating: 50mA; Illumination Type: Non-Illuminated,Illuminated; Actuator Length: 1.6mm; Supplier 1: Digi-Key; Stock 1: 2282; Packaging: Tape and Reel; Supplier Part Number 1: 732-6993-1-ND; Manufacturer Part Number: 430152050826; Supplier 2: Farnell; Supplier 3: RSComponents; Supplier Part Number 2: 2065110; Supplier Part Number 3: 7856213; Pricing 1: 1=0.47, 500=0.38232 (USD); Mount: Surface Mount; Contact Material: Stainless Steel,Steel; Min Operating Temperature: -40°C; Max Operating Temperature: 85°C; Current Rating: 50mA; Termination: Gull Wing; Throw Configuration: SPST; Length: 6.2mm; Height: 5mm; Width: 6.2mm; REACH SVHC: No SVHC; ComponentLink1URL: http://www.farnell.com/datasheets/1910150.pdf?src-supplier=Element14; ComponentLink1Description: wurth datasheet online; ComponentLink2Description: wurth datasheet; ComponentLink2URL: Y:\System\Altium\Libraries 2014\Wurth\Datasheets\4301x2xxx8x6 1910150.pdf
U1 = ST STM32F411CEU6: ARM Cortex M4 MCU+FPU 512k Flash, 128k RAM, 100MHz, QFPN48; RAM Size: 128KB; Max Power Dissipation: 625mW; Interface: I2C,I2S,IrDA,LIN,MMC,SD,SDIO,SPI,UART,USART,USB; Number of I/Os: 36; Number of Timers/Counters: 8; Oscillator Type: Internal; Min Supply Voltage: 1.7V; Max Supply Voltage: 3.6V; Data Bus Width: 32b; Watchdog Timer: Yes; Memory Size: 512KB; Number of ADC Channels: 16; Peripherals: Brown-out Detect/Reset,DMA,POR,PWM,WDT; Operating Supply Voltage: 3.3V; ComponentLink1Description: ST datasheet; ComponentLink1URL: https://www.st.com/resource/en/datasheet/stm32f411vc.pdf; Supplier 1: Digi-Key; Stock 1: 16657; Pricing 1: 1=6.25, 10=5.65, 260=4.46708, 520=4.07294, 1040=3.54739 (USD); Mount: Surface Mount; Case/Package: UFQFPN; Number of Pins: 48; Min Operating Temperature: -40°C; Max Operating Temperature: 85°C; Packaging: Tray; Frequency: 100MHz; Number of Programmable I/O: 36; Max Frequency: 100MHz; Memory Type: FLASH; Package Quantity: 1560; Core Architecture: ARM; Length: 7mm; Width: 7mm; Radiation Hardening: No; Lead Free: Lead Free; REACH SVHC: No SVHC; Supplier 2: Farnell; Supplier 3: Mouser; Supplier 4: RSComponents; Supplier Part Number 1: 497-14907-ND; Supplier Part Number 2: 2456965; Supplier Part Number 3: 511-STM32F411CEU6; Supplier Part Number 4: 1106616
X1 = 24MHz SMD xtal 3.2x2.5mm: Generic 3.2x2.5mm 24MHz 12pF SMD xtal, e.g. Multicomp MCSJK-7U-24.00-12-10-60-B-10; Tolerance: ±10ppm; ESR: 60R; Stability: *; Footprint: SMD 3225; Manufacturer Part Number: MCSJK-7U-24.00-12-10-60-B-10; Supplier 1: Farnell; Manufacturer: Multicomp; Stock 1: 2335; Pricing 1: 5=0.14, 50=0.114, 250=0.105, 500=0.099, 1500=0.095, 3000=0.086, 15000=0.0843 (GBP); Supplier Part Number 1: 2853960; ComponentLink1Description: online datasheet; ComponentLink1URL: http://www.farnell.com/datasheets/2645227.pdf?_ga=2.202843601.1706070776.1558802095-240913015.1522930266; ComponentLink2Description: datasheet; ComponentLink2URL: Y:\System\Altium\Libraries 2014\Multicomp\datasheets\MCSJK-7U 3.2x2.5mm SMD xtals.pdf